# EAGLE design wifi2Nmea183 (EAGLE 7.7.0)
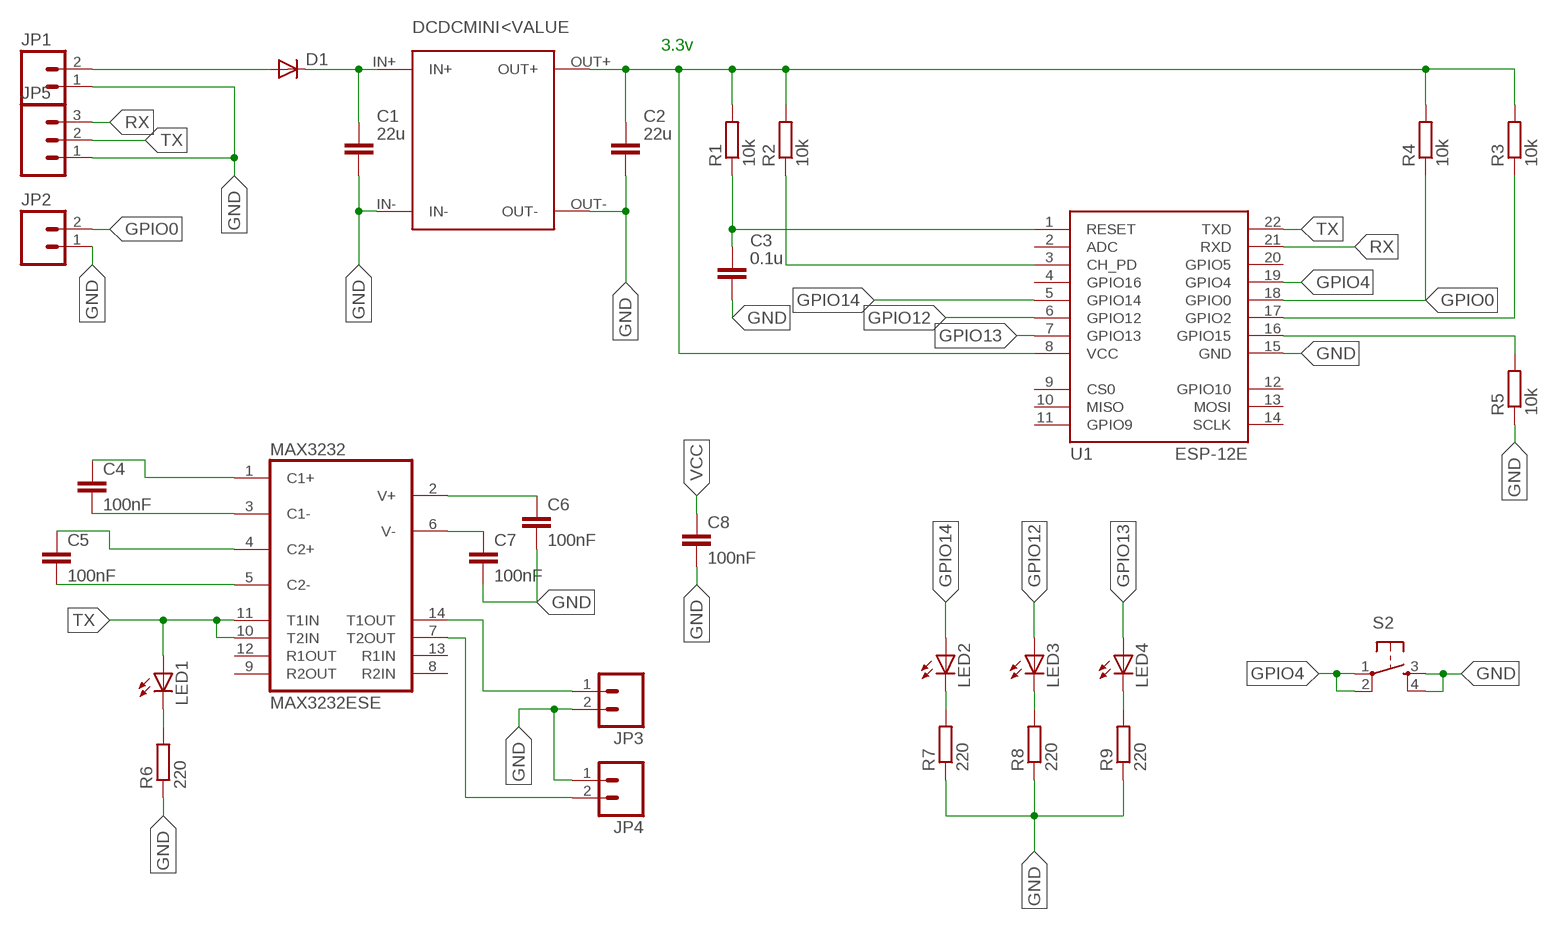
[diagram p0: schematic, sheet 1]

## Parts
C1  22u  CAPACITOR_NPOL-1206  [C1206]
C2  22u  CAPACITOR_NPOL-1206  [C1206]
C3  0.1u  CAPACITOR_NPOL-0805  [C805]
C4  100nF  CAP0805  [0805]
C5  100nF  CAP0805  [0805]
C6  100nF  CAP0805  [0805]
C7  100nF  CAP0805  [0805]
C8  100nF  CAP0805  [0805]
D1  DIODE-DO214AC  [DO214AC]
DCDCMINI  DCDCMINI  [DCDCMINI]
JP1  M02LOCK  [1X02_LOCK]
JP2  M02LOCK  [1X02_LOCK]
JP3  M02LOCK  [1X02_LOCK]
JP4  M02LOCK  [1X02_LOCK]
JP5  M03LOCK  [1X03_LOCK]
LED1  LED3MM  [LED3MM]
LED2  LED3MM  [LED3MM]
LED3  LED3MM  [LED3MM]
LED4  LED3MM  [LED3MM]
MAX3232  MAX3232ESE  [SO16]
R1  10k  R-EU_R0805  [R0805]
R2  10k  R-EU_R0805  [R0805]
R3  10k  R-EU_R0805  [R0805]
R4  10k  R-EU_R0805  [R0805]
R5  10k  R-EU_R0805  [R0805]
R6  220  R-EU_R0805  [R0805]
R7  220  R-EU_R0805  [R0805]
R8  220  R-EU_R0805  [R0805]
R9  220  R-EU_R0805  [R0805]
S2  TAC_SWITCHPTH  [TACTILE-PTH]
U1  ESP-12E  [ESP-12E]

## Nets
GND: C1.2 C2.2 C3.2 C6.2 C7.2 C8.2 DCDCMINI.IN- DCDCMINI.OUT- JP1.1 JP2.1 JP3.2 JP4.1 JP5.1 R5.1 R6.1 R7.1 R8.1 R9.1 S2.3 S2.4 U1.15(GND)
GPIO0: JP2.2 R4.1 U1.18(GPIO0)
GPIO4: S2.1 S2.2 U1.19(GPIO4)
GPIO12: LED3.A U1.6(GPIO12)
GPIO13: LED4.A U1.7(GPIO13)
GPIO14: LED2.A U1.5(GPIO14)
N$1 [12v]: D1.A JP1.2
N$2 [12v]: C1.1 D1.C DCDCMINI.IN+
N$4: C3.1 R1.1 U1.1(RESET)
N$5: R2.1 U1.3(CH_PD)
N$6: R3.1 U1.17(GPIO2)
N$7: R5.2 U1.16(GPIO15)
N$8: C6.1 MAX3232.2(V+)
N$9: C7.1 MAX3232.6(V-)
N$10: C5.2 MAX3232.5(C2-)
N$11: C5.1 MAX3232.4(C2+)
N$12: C4.2 MAX3232.3(C1-)
N$13: C4.1 MAX3232.1(C1+)
N$14: JP3.1 MAX3232.14(T1OUT)
N$15: JP4.2 MAX3232.7(T2OUT)
N$16: LED1.K(C) R6.2
N$19: LED2.K(C) R7.2
N$20: LED3.K(C) R8.2
N$21: LED4.K(C) R9.2
RX: JP5.3 U1.21(RXD)
TX: JP5.2 LED1.A MAX3232.10(T2IN) MAX3232.11(T1IN) U1.22(TXD)
VCC [VCC]: C2.1 C8.1 DCDCMINI.OUT+ R1.2 R2.2 R3.2 R4.2 U1.8(VCC)
Unconnected: MAX3232.8(R2IN) MAX3232.9(R2OUT) MAX3232.12(R1OUT) MAX3232.13(R1IN) U1.2(ADC) U1.4(GPIO16) U1.9(CS0) U1.10(MISO) U1.11(GPIO9) U1.12(GPIO10) U1.13(MOSI) U1.14(SCLK) U1.20(GPIO5)

## Notes on the sheet
- 3.3v

## Power pins joined to a net without a drawn wire
GND: MAX3232.15(GND)
VCC: MAX3232.16(VCC)

## Library data of the parts
C1-C3 = dp_devices.v6:CAPACITOR_NPOL: Non-Polarized capacitor in various packages
C4-C8 = SparkFun:CAP: Capacitor Standard 0603 ceramic capacitor, and 0.1" leaded capacitor.
D1 = diode:DIODE-: DIODE
DCDCMINI = DCDCMINI:DCDCMINI
JP1-JP4 = SparkFun:M02: Header 2 Standard 2-pin 0.1" header. Use with straight break away headers (SKU : PRT-00116), right angle break away headers (PRT-00553), swiss pins (PRT-00743), machine pins (PRT-00117), and female headers (PRT-00115). Molex polarized connector foot print use with SKU : PRT-08233 with associated crimp pins and housings.
JP5 = SparkFun:M03: Header 3 Standard 3-pin 0.1" header. Use with straight break away headers (SKU : PRT-00116), right angle break away headers (PRT-00553), swiss pins (PRT-00743), machine pins (PRT-00117), and female headers (PRT-00115). Molex polarized connector foot print use with SKU : PRT-08232 with associated crimp pins and housings.
LED1-LED4 = adafruit:LED: LED OSRAM: - CHIPLED LG R971, LG N971, LY N971, LG Q971, LY Q971, LO R971, LY R971 LH N974, LH R974 LS Q976, LO Q976, LY Q976 LO Q996 - Hyper CHIPLED LW Q18S LB Q993, LB Q99A, LB R99A - SideLED LS A670, LO A670, LY A670, LG A670, LP A670 LB A673, LV A673, LT A673, LW A673 LH A674 LY A675 LS A676, LA A676, LO A676, LY A676, LW A676 LS A679, LY A679, LG A679 - Hyper Micro SIDELED® LS Y876, LA Y876, LO Y876, LY Y876 LT Y87S - SmartLED LW L88C, LW L88S LB L89C, LB L89S, LG L890 LS L89K, LO L89K, LY L89K LS L896, LA L896, LO L896, LY L896 - TOPLED LS T670, LO T670, LY T670, LG T670, LP T670 LSG T670, LSP T670, LSY T670, LOP T670, LYG T670 LG T671, LOG T671, LSG T671 LB T673, LV T673, LT T673, LW T673 LH T674 LS T676, LA T676, LO T676, LY T676, LB T676, LH T676, LSB T676, LW T676 LB T67C, LV T67C, LT T67C, LS T67K, LO T67K, LY T67K, LW E67C LS E67B, LA E67B, LO E67B, LY E67B, LB E67C, LV E67C, LT E67C LW T67C LS T679, LY T679, LG T679 LS T770, LO T770, LY T770, LG T770, LP T770 LB T773, LV T773, LT T773, LW T773 LH T774 LS E675, LA E675, LY E675, LS T675 LS T776, LA T776, LO T776, LY T776, LB T776 LHGB T686 LT T68C, LB T68C - Hyper Mini TOPLED® LB M676 - Mini TOPLED Santana® LG M470 LS M47K, LO M47K, LY M47K Source: http://www.osram.convergy.de/
MAX3232 = maxim-3:MAX3232*: True RS-232 Transceivers 3.0V to 5.5V, Low-Power up to 1Mbps, Using Four 0.1µF External Capacitors Source: http://pdfserv.maxim-ic.com/en/ds/MAX3222-MAX3241.pdf
R1-R9 = resistor:R-EU_: RESISTOR, European symbol
S2 = SparkFun:TAC_SWITCH: Momentary Switch Button commonly used for reset or general input. Spark Fun Electronics SKU : COM-00097
U1 = esp8266:ESP-12E: Ai-Thinker ESP-12E

## Module DCDCMINI
Ports: 

### Library data of the parts

## Net classes
1 VCC: width 0.635 mm
2 12v: width 1.016 mm

## Board
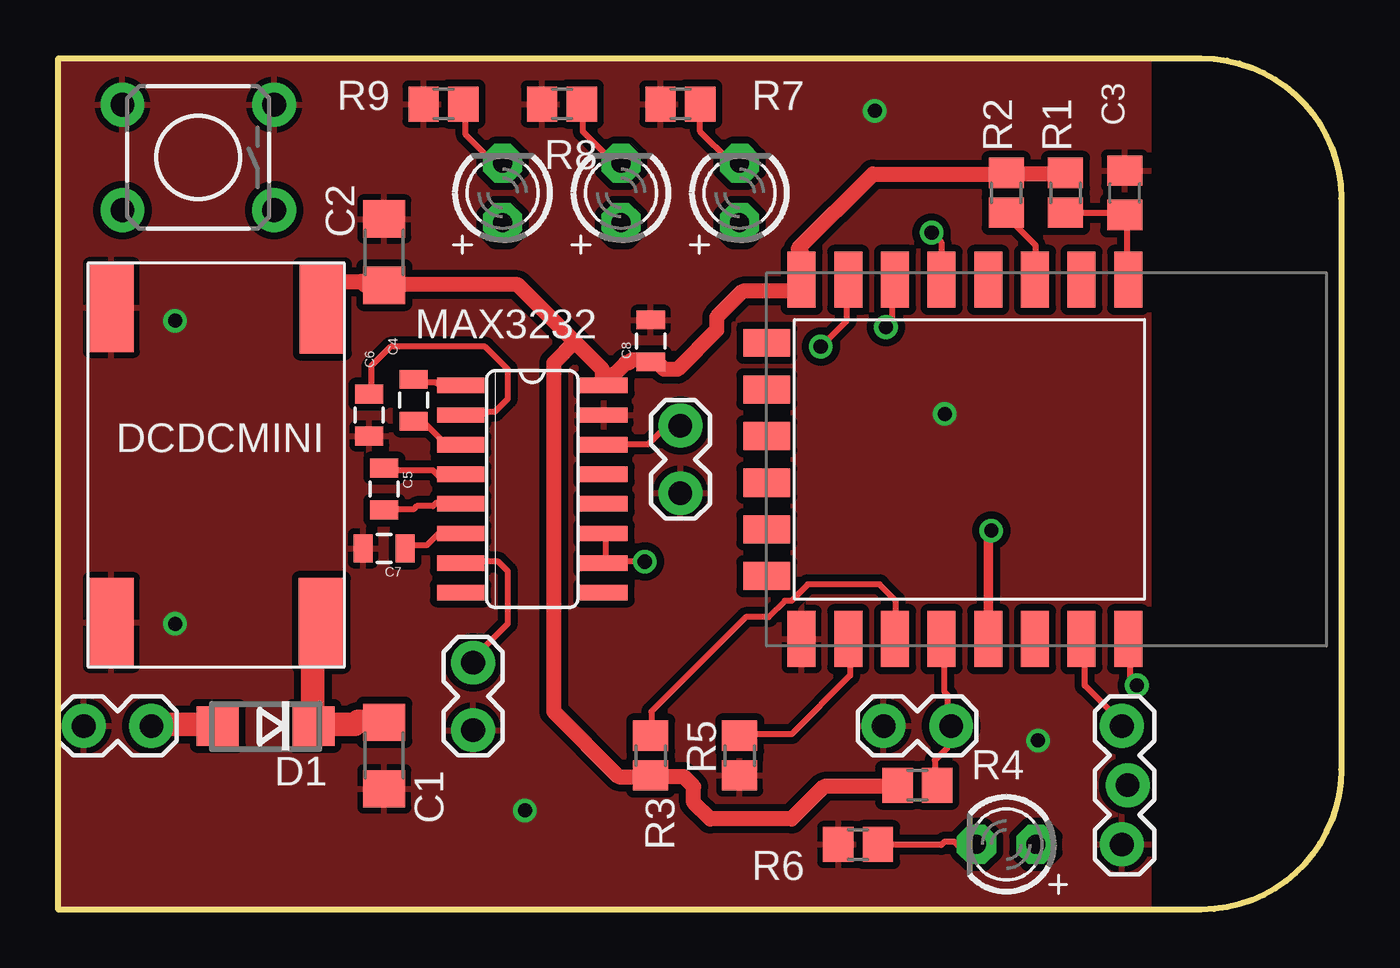
[diagram p1: board, top side]
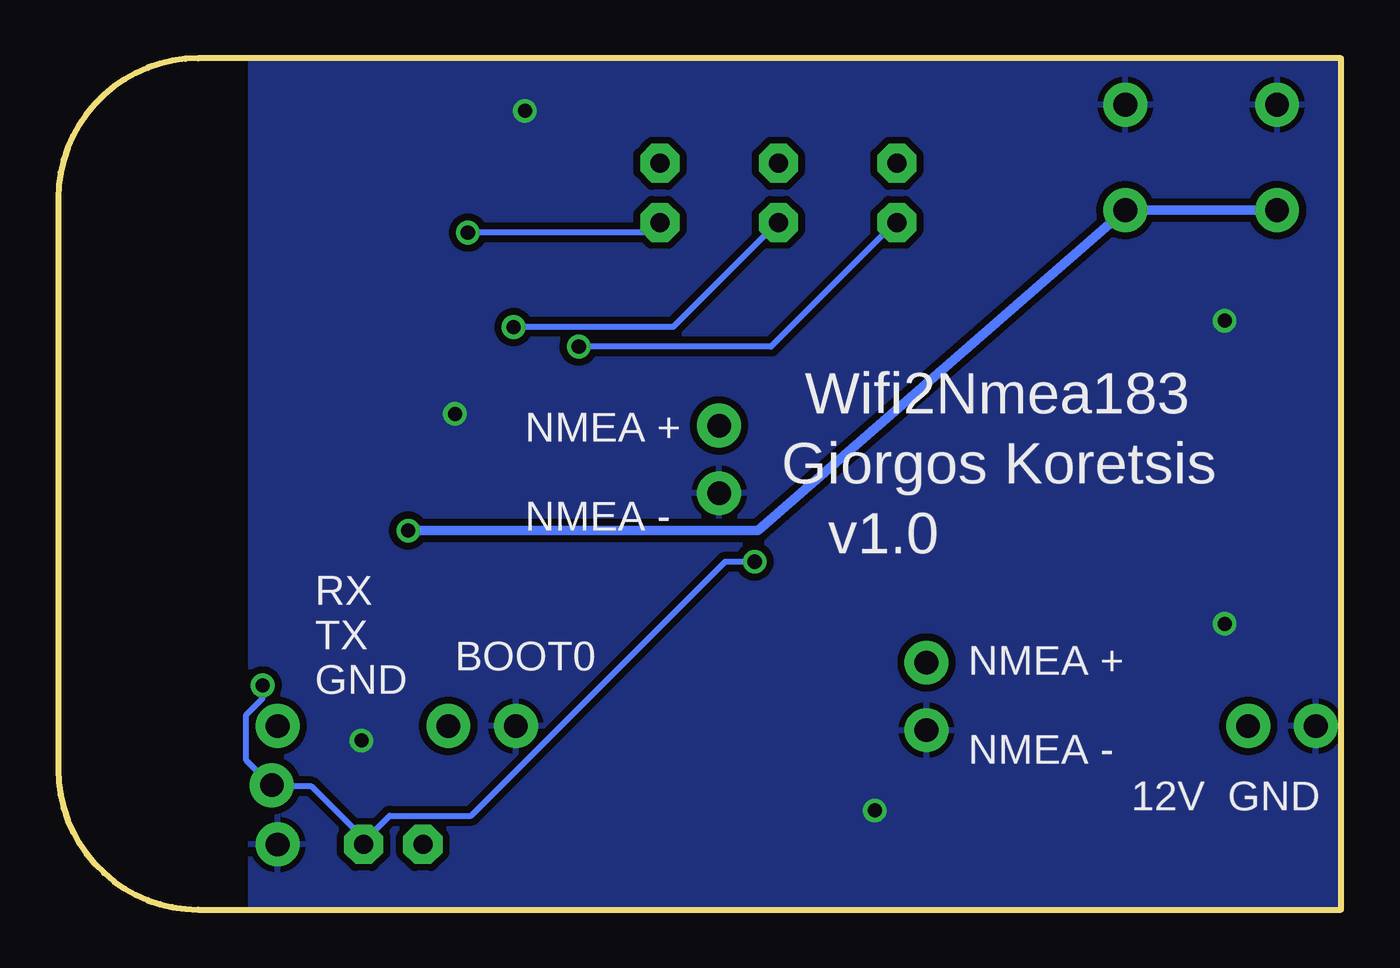
[diagram p2: board, bottom side, seen from below]

Size 55 x 36.5 mm. Coordinates in mm from the lower left corner, seen from the top.
Outline: 0,0 0,36.5 49,36.5 arc-90 55,30.5 55,6 arc-90 49,0 0,0
Copper layers (1*16): Top 0.035mm / dielectric 1.5mm / Bottom 0.035mm
Design rules "default *": minimum track width 10mil, minimum drill 24mil, track to track 12mil, track to pad 8mil, pad to pad 8mil, via to via 8mil, smd to smd 8mil, copper to edge 0mil, drill to drill 8mil, minimum pad ring 10mil, minimum via ring 8mil, stop-mask expansion 4mil, vias tented up to drill 0mil, thermal gap 10mil
tRestrict: area 47,0 to 55,36.5
bRestrict: area 47,0 to 55,36.5

### Footprints (pad centres in the part's own frame; a part is rotated, then mirrored left to right if it is on the bottom)
C1206 = smd 1.6 x 1.803: 1 -1.422,0; 2 1.422,0
C805 = smd 1.3 x 1.5: 1 -0.95,0; 2 0.95,0
0805 = smd 0.8 x 1.2: 1 -0.9,0; 2 0.9,0
DO214AC = smd 1.8 x 1.7: A 2.05,0; C -2.05,0
DCDCMINI = smd 1.93 x 3.81: IN+ 10,1.9; IN- 1,1.9; OUT+ 10.05,15.34; OUT- 1,15.4
1X02_LOCK = drill 1.016 pad 1.88: 1 -0.178,0; 2 2.718,0
1X03_LOCK = drill 1.016 pad 1.88: 1 0,0.127; 2 2.54,-0.127; 3 5.08,0.127
LED3MM = drill 0.813 pad 1.676 octagon: A -1.27,0; K 1.27,0
SO16 = smd 0.66 x 2.032: 1 -4.445,-3.073; 2 -3.175,-3.073; 3 -1.905,-3.073; 4 -0.635,-3.073; 5 0.635,-3.073; 6 1.905,-3.073; 7 3.175,-3.073; 8 4.445,-3.073; 9 4.445,3.073; 10 3.175,3.073; 11 1.905,3.073; 12 0.635,3.073; 13 -0.635,3.073; 14 -1.905,3.073; 15 -3.175,3.073; 16 -4.445,3.073
R0805 = smd 1.3 x 1.5: 1 -0.85,0; 2 0.85,0
TACTILE-PTH = drill 1.016 pad 1.88: 1 -3.251,2.261; 2 3.251,2.261; 3 -3.251,-2.261; 4 3.251,-2.261
ESP-12E = smd 2.4 x 1.2: 1 -7.7,4.5; 2 -7.7,2.5; 3 -7.7,0.5; 4 -7.7,-1.5; 5 -7.7,-3.5; 6 -7.7,-5.5; 7 -7.7,-7.5; 8 -7.7,-9.5; 15 7.7,-9.5; 16 7.7,-7.5; 17 7.7,-5.5; 18 7.7,-3.5; 19 7.7,-1.5; 20 7.7,0.5; 21 7.7,2.5; 22 7.7,4.5 | smd 1.2 x 2: 9 -5,-11; 10 -3,-11; 11 -1,-11; 12 1,-11; 13 3,-11; 14 5,-11

### Placement (x,y rotation side)
C1  13.97,6.6 270 top
C2  13.97,28.19 90 top
C3  45.72,30.73 90 top
C4  15.24,21.84 270 top
C5  13.97,18.03 270 top
C6  13.34,21.2 270 top
C7  13.97,15.49 180 top
C8  25.4,24.38 90 top
D1  8.89,7.87 180 top
DCDCMINI  1.27,10.41 0 top
JP1  1.27,7.87 0 top
JP2  35.56,7.87 0 top
JP3  26.67,20.57 270 top
JP4  17.78,7.87 90 top
JP5  45.72,2.79 90 top
LED1  40.64,2.79 180 top
LED2  29.21,30.73 90 top
LED3  24.13,30.73 90 top
LED4  19.05,30.73 90 top
MAX3232  20.32,18.03 270 top
R1  43.18,30.73 90 top
R2  40.64,30.73 90 top
R3  25.4,6.6 270 top
R4  36.83,5.33 180 top
R5  29.21,6.6 90 top
R6  34.29,2.79 0 top
R7  26.67,34.54 0 top
R8  21.59,34.54 0 top
R9  16.51,34.54 0 top
S2  6,32.25 180 top
U1  41.37,19.3 270 top

### Tracks (layer width: path | path; a pad name or v marks a point on that pad's centre or on a via)
GND  (via drill 0.6)
  other vias: 5,25.25 20,4.25 42,7.25 38,21.25 5,12.25 35,34.25
  pour Bottom: 0,0.25 0,36.25 47,36.25 49,36.25 arc-90 55,30.25 55,6.25 arc-90 49,0.25 47,0.25
  pour Top: 0,0.25 0,36.25 47,36.25 49,36.25 arc-90 55,30.25 55,6.25 arc-90 49,0.25 47,0.25
GPIO0
  Top 0.254: R4.1 37.58,5.42 37.58,6.4 38.14,6.96 38.14,7.65 38.28,7.79 JP2.2 38.28,8.63 38.14,8.77 38.14,9.19 38,9.33 38,11.57 U1.18
GPIO4  (via drill 0.6)
  Top 0.406: v40,16.25 39.87,16.12 U1.19
  Bottom 0.406: S2.2 S2.1 25,16.25 v40,16.25
GPIO12  (via drill 0.61)
  Top 0.254: v35.48,24.98 35.76,25.26 35.76,26.93 U1.6
  Bottom 0.254: v35.48,24.98 28.64,24.98 24.17,29.45 LED3.A
GPIO13  (via drill 0.61)
  Top 0.254: v32.69,24.14 33.81,25.26 33.81,26.93 U1.7
  Bottom 0.254: v32.69,24.14 24.45,24.14 19.14,29.45 LED4.A
GPIO14  (via drill 0.61)
  Top 0.254: v37.44,29.03 37.86,28.61 37.86,27.07 U1.5
  Bottom 0.254: v37.44,29.03 29.76,29.03 29.34,29.45 LED2.A
N$1
  Top 1.016: D1.A 6.71,7.93 4.05,7.93 JP1.2
N$2
  Top 1.016: DCDCMINI.IN+ 10.9,11.01 10.9,7.93 D1.C 11.46,7.93 12.71,7.93 12.85,8.07 13.97,8.07 C1.1
N$4
  Top 0.254: U1.1 45.82,27.07 45.82,29.73 C3.1 45.68,29.87 43.31,29.87 R1.1
N$5
  Top 0.254: R2.1 40.65,29.87 41.07,29.45 41.07,29.31 41.91,28.47 41.91,27.07 U1.3
N$6
  Top 0.254: R3.1 25.43,7.51 25.43,8.49 29.48,12.54 30.45,12.54 31.15,13.24 31.43,13.24 32.13,13.94 35.2,13.94 35.9,13.24 35.9,11.71 U1.17
N$7
  Top 0.254: R5.2 29.34,7.51 31.43,7.51 33.95,10.03 33.95,11.57 U1.16
N$8
  Top 0.254: MAX3232.2 18.16,21.2 18.3,21.34 18.72,21.34 19.28,21.9 19.28,23.16 18.3,24.14 14.25,24.14 13.41,23.3 13.41,22.18 C6.1
N$9
  Top 0.254: C7.1 14.95,15.62 15.79,15.62 16.34,16.18 17.18,16.18 MAX3232.6
N$10
  Top 0.254: C5.2 13.97,17.15 15.23,17.15 15.37,17.29 16.07,17.29 16.2,17.43 17.18,17.43 MAX3232.5
N$11
  Top 0.254: C5.1 13.97,18.83 16.07,18.83 16.34,18.55 17.18,18.55 MAX3232.4
N$12
  Top 0.254: C4.2 15.37,20.93 15.65,20.93 16.62,19.95 17.18,19.95 MAX3232.3
N$13
  Top 0.254: C4.1 15.37,22.6 16.2,22.6 16.34,22.46 17.18,22.46 MAX3232.1
N$14
  Top 0.254: MAX3232.14 23.47,19.95 25.29,19.95 25.98,20.65 26.54,20.65 JP3.1
N$15
  Top 0.254: MAX3232.7 17.32,14.92 18.86,14.92 19.28,14.5 19.28,12.26 17.88,10.87 17.88,10.59 JP4.2
N$16
  Top 0.254: R6.2 35.2,2.77 37.86,2.77 38,2.9 38.42,2.9 38.7,2.62 39.12,2.62 39.26,2.77 LED1.K
N$19
  Top 0.254: R7.2 27.52,34.48 27.52,33.36 28.78,32.1 29.2,32.1 LED2.K
N$20
  Top 0.254: R8.2 22.49,34.48 22.49,33.36 23.75,32.1 24.03,32.1 LED3.K
N$21
  Top 0.254: R9.2 17.46,34.48 17.46,33.22 18.58,32.1 19,32.1 LED4.K
RX
  Top 0.254: U1.21 44.01,11.57 44.01,9.61 45.68,7.93 JP5.3
TX  (via drill 0.61)
  Top 0.254: v46.24,9.61 45.96,9.89 45.96,11.57 U1.22 | 23.47,14.92 23.47,16.04 MAX3232.11 | v25.15,14.92 23.47,14.92 | 23.47,14.92 MAX3232.10
  Bottom 0.254: v46.24,9.61 46.24,9.05 46.94,8.35 46.94,6.4 45.96,5.42 JP5.2 45.82,5.28 44.15,5.28 41.91,3.04 LED1.A 41.91,2.9 40.79,4.02 37.3,4.02 26.4,14.92 v25.15,14.92
VCC
  Top 0.635: R4.2 35.9,5.28 32.83,5.28 31.43,3.88 27.94,3.88 27.24,4.58 27.24,5.28 26.82,5.7 25.43,5.7 R3.2 25.15,5.7 24.03,5.7 21.23,8.49 21.23,23.44 22.14,24.35 | DCDCMINI.OUT+ 11.04,26.93 12.99,26.93 13.13,26.79 13.97,26.79 C2.1 14.25,26.79 19.7,26.79 22.14,24.35 | 23.54,22.67 23.47,22.6 MAX3232.16 | 23.54,22.67 24.31,23.44 24.45,23.44 24.59,23.58 25.29,23.58 C8.1 25.7,23.44 25.98,23.16 26.54,23.16 28.22,24.84 28.22,25.4 29.34,26.51 31.57,26.51 31.85,26.79 U1.8 31.85,27.07 31.85,28.19 31.71,28.33 34.92,31.54 40.37,31.54 R2.2 40.65,31.54 43.17,31.54 R1.2 | 22.14,24.35 23.33,23.16 23.33,22.88 23.54,22.67

### Text on the board
bNames: Wifi2Nmea183 | Giorgos Koretsis | NMEA + / / NMEA - | v1.0 | BOOT0 | RX / TX / GND | NMEA + / / NMEA - | 12V GND